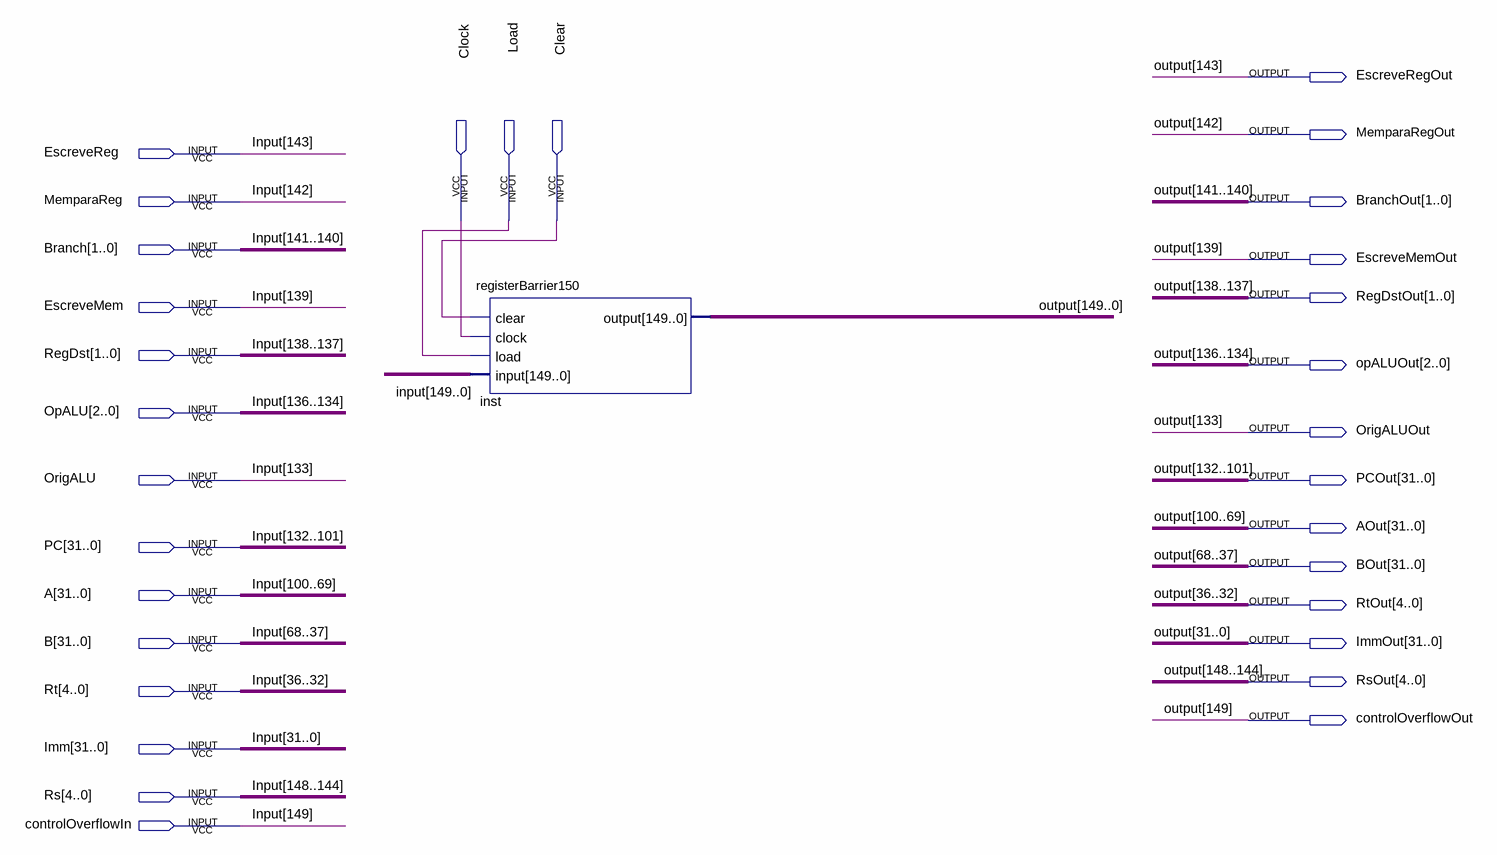
[diagram p0: schematic sheet]
// Quartus schematic IDEX.bdf as structural Verilog: 1 symbols, 31 pins
module IDEX (
  input  EscreveReg,
  input  MemparaReg,
  input  Clock,
  input  Load,
  input  Clear,
  input  [1:0] Branch,
  input  EscreveMem,
  input  [1:0] RegDst,
  input  [2:0] OpALU,
  input  OrigALU,
  input  [31:0] PC,
  input  [31:0] A,
  input  [31:0] B,
  input  [4:0] Rt,
  input  [31:0] Imm,
  input  [4:0] Rs,
  input  controlOverflowIn,
  output EscreveRegOut,
  output MemparaRegOut,
  output [1:0] BranchOut,
  output EscreveMemOut,
  output [1:0] RegDstOut,
  output [2:0] opALUOut,
  output OrigALUOut,
  output [31:0] PCOut,
  output [31:0] AOut,
  output [31:0] BOut,
  output [4:0] RtOut,
  output [31:0] ImmOut,
  output [4:0] RsOut,
  output controlOverflowOut
);

  registerBarrier150 inst (
    .clear(Clear), .clock(Clock), .load(Load),
    .\input ({controlOverflowIn, Rs, EscreveReg, MemparaReg, Branch, EscreveMem, RegDst, OpALU, OrigALU, PC, A, B, Rt, Imm}),
    .\output ({controlOverflowOut, RsOut, EscreveRegOut, MemparaRegOut, BranchOut, EscreveMemOut, RegDstOut, opALUOut, OrigALUOut, PCOut, AOut, BOut, RtOut, ImmOut}));

  // Other names for the same wires on the sheet: Input[149:0] = {controlOverflowIn, Rs, EscreveReg, MemparaReg, Branch, EscreveMem, RegDst, OpALU, OrigALU, PC, A, B, Rt, Imm};
  //   output[149:0] = {controlOverflowOut, RsOut, EscreveRegOut, MemparaRegOut, BranchOut, EscreveMemOut, RegDstOut, opALUOut, OrigALUOut, PCOut, AOut, BOut, RtOut, ImmOut}
endmodule
